# Altium schematic sheet Filter.SchDoc: Filter & amplification
size A4; Author: Jose Luis Llorente Gonzalez; CompanyName: ETSIT; Organization: UPM; Revision: V1.0
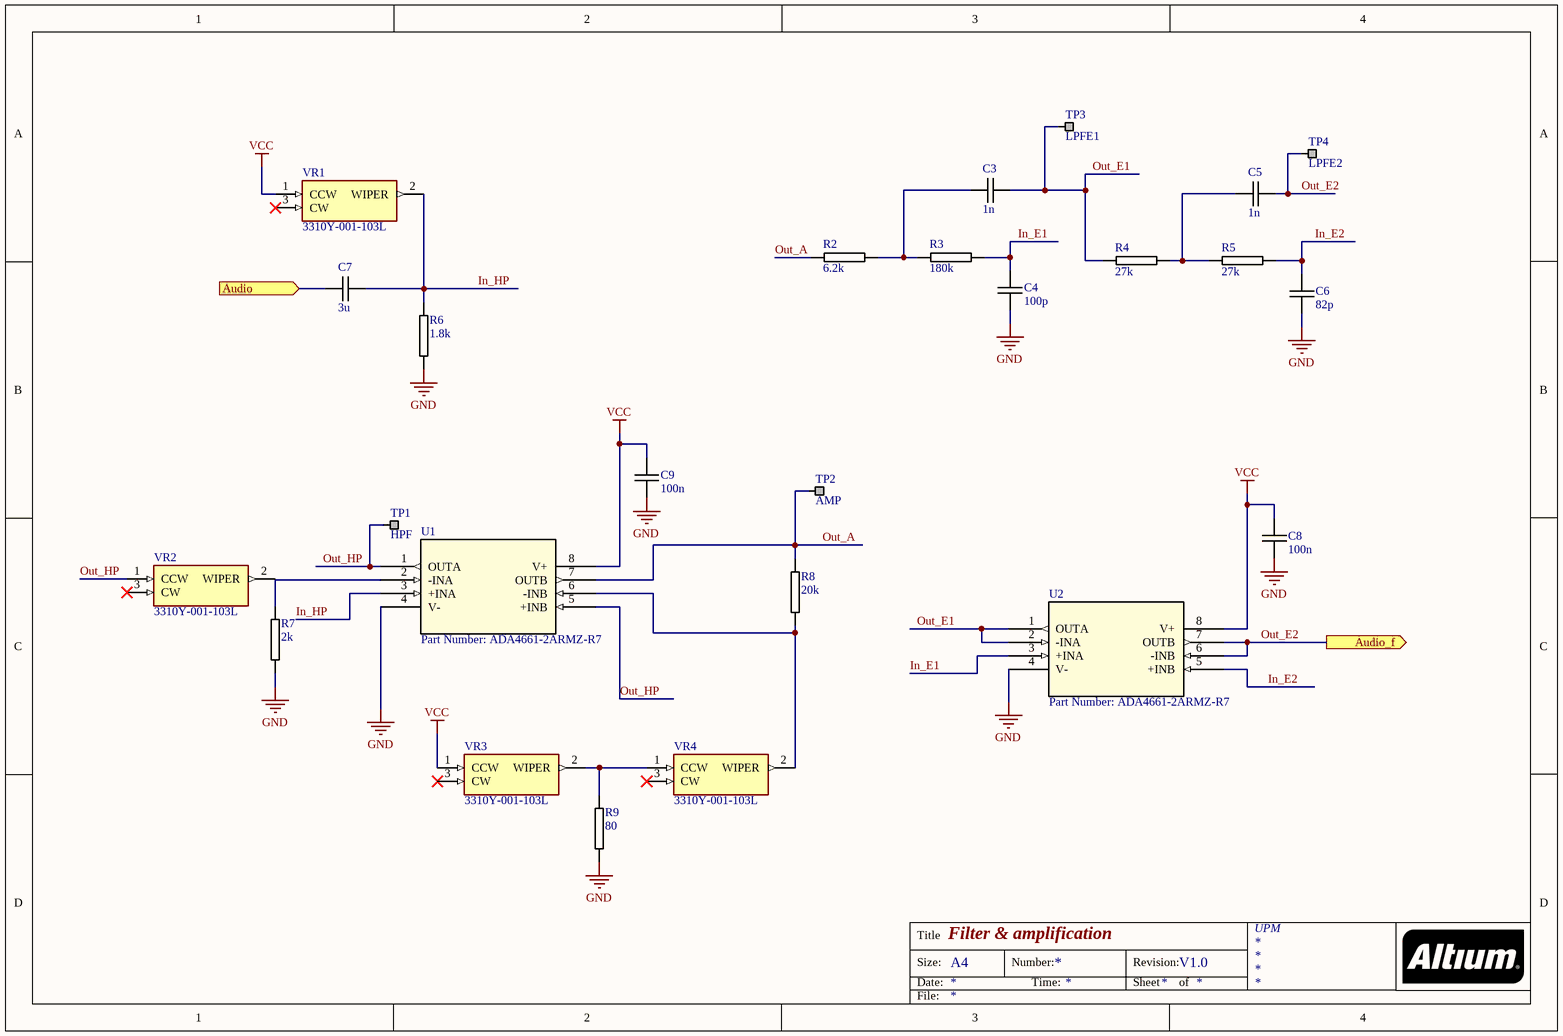
[diagram p0: Filter.SchDoc]

## Parts
C3  1n  [0805C-GENERIC]
C4  100p  [0805C-GENERIC]
C5  1n  [0805C-GENERIC]
C6  82p  [0805C-GENERIC]
C7  3u  [0805C-GENERIC]
C8  100n  [0805C-GENERIC]
C9  100n  [0805C-GENERIC]
R2  6.2k  [0805R-GENERIC]
R3  180k  [0805R-GENERIC]
R4  27k  [0805R-GENERIC]
R5  27k  [0805R-GENERIC]
R6  1.8k  [0805R-GENERIC]
R7  2k  [0805R-GENERIC]
R8  20k  [0805R-GENERIC]
R9  80  [0805R-GENERIC]
TP1  HPF  [TESTPIN]
TP2  AMP  [TESTPIN]
TP3  LPFE1  [TESTPIN]
TP4  LPFE2  [TESTPIN]
U1  Part Number: ADA4661-2ARMZ-R7  [RM_8]
U2  Part Number: ADA4661-2ARMZ-R7  [RM_8]
VR1  3310Y-001-103L  [3310Y-001]
VR2  3310Y-001-103L  [3310Y-001]
VR3  3310Y-001-103L  [3310Y-001]
VR4  3310Y-001-103L  [3310Y-001]

## Ports
Audio (in), Audio_f (out)

## Nets
GND: C4.1 C6.1 C8.2 C9.2 R6.2 R7.2 R9.2 U1.4(V-) U2.4(V-)
VCC: C8.1 C9.1 U1.8(V+) U2.8(V+) VR1.1(CCW) VR3.1(CCW)
Audio: C7.1 ; port Audio
In_E1: C4.2 R3.2 U2.3(+INA)
In_E2: C6.2 R5.2 U2.5(+INB)
In_HP: C7.2 R6.1 U1.3(+INA) VR1.2(WIPER)
Out_A: R2.1 R8.1 TP2.1 U1.7(OUTB)
Out_E1: C3.2 R4.1 TP3.1 U2.1(OUTA) U2.2(-INA)
Out_E2: C5.2 TP4.1 U2.6(-INB) U2.7(OUTB) ; port Audio_f
Out_HP: TP1.1 U1.1(OUTA) U1.5(+INB) VR2.1(CCW)
NetC3_1: C3.1 R2.2 R3.1
NetC5_1: C5.1 R4.2 R5.1
NetR7_1: R7.1 U1.2(-INA)
NetR8_2: R8.2 U1.6(-INB) VR4.2(WIPER)
NetR9_1: R9.1 VR3.2(WIPER) VR4.1(CCW)

Not connected (* = marked no-connect by the designer): VR1 3(CW)*; VR2 2(WIPER) 3(CW)*; VR3 3(CW)*; VR4 3(CW)*

## Notes on the sheet
- Title
- Size:
- Date:
- A4
- Number:
- Time:
- Revision:
- Sheet
- of
- File:

## Library data of the parts
C3-C9 = C0805-GENERIC: GENERIC CAPACITOR NON POLARISED0603
R2-R9 = R0805-GENERIC: GENERIC RESISTOR 0805
TP1-TP4 = TESTPIN: TESTPIN SINGLE PIN HEADER; Manufacturer 1: Sharon Long Industries; Manufacturer Part Number 1: Cut-it-yourself; Reel: TH; Supplier 1: Sharon Long Industries; Supplier 1 Part number: Cut-It-Yourself
U1 U2 = ADA4661-2ARMZ-R7: No Description Available; Built_By: EMA_Christopher; Vendor: Analog Devices Inc; Copyright: Copyright (C) 2016 Accelerated Designs. All rights reserved; Manufacturer_Part_Number: ADA4661-2ARMZ-R7; RefDes: RefDes; Type: DEV; Value: Value
VR1-VR4 = 3310Y-001-103L: Variable Resistor; Manufacturer_Name: Bourns; Datasheet Link: http://www.bourns.com/docs/Product-Datasheets/3310.pdf; Manufacturer_Part_Number: 3310Y-001-103L; Mouser Part Number: 652-3310Y-001-103L; Mouser Price/Stock: https://www.mouser.com/Search/Refine.aspx?Keyword=652-3310Y-001-103L; RS Part Number: 5220625P; RS Price/Stock: http://uk.rs-online.com/web/p/products/5220625P